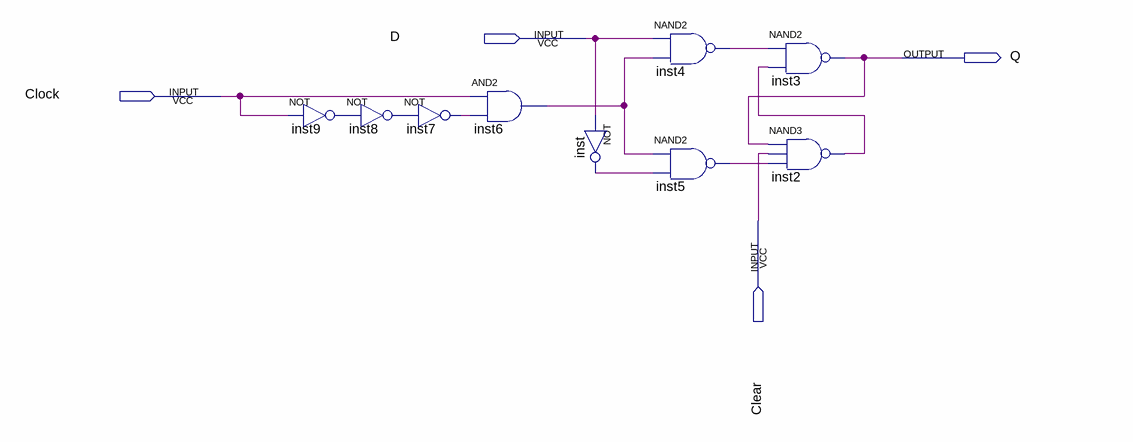
[diagram p0: schematic sheet]
// Quartus schematic FFD.bdf as structural Verilog: 9 symbols, 4 pins
module FFD (
  input  D,
  input  Clock,
  input  Clear,
  output Q
);

  wire inst2_out, inst4_out, inst5_out, inst6_out, inst7_out, inst8_out, inst9_out, inst_out;

  not inst9 (inst9_out, Clock);
  not inst8 (inst8_out, inst9_out);
  not inst7 (inst7_out, inst8_out);
  and inst6 (inst6_out, Clock, inst7_out);
  not inst (inst_out, D);
  nand inst4 (inst4_out, D, inst6_out);
  nand inst5 (inst5_out, inst6_out, inst_out);
  nand inst3 (Q, inst4_out, inst2_out);
  nand inst2 (inst2_out, Q, Clear, inst5_out);
endmodule
